# EAGLE design PMXAS5600N12_V1.0 (EAGLE 9.2.2)
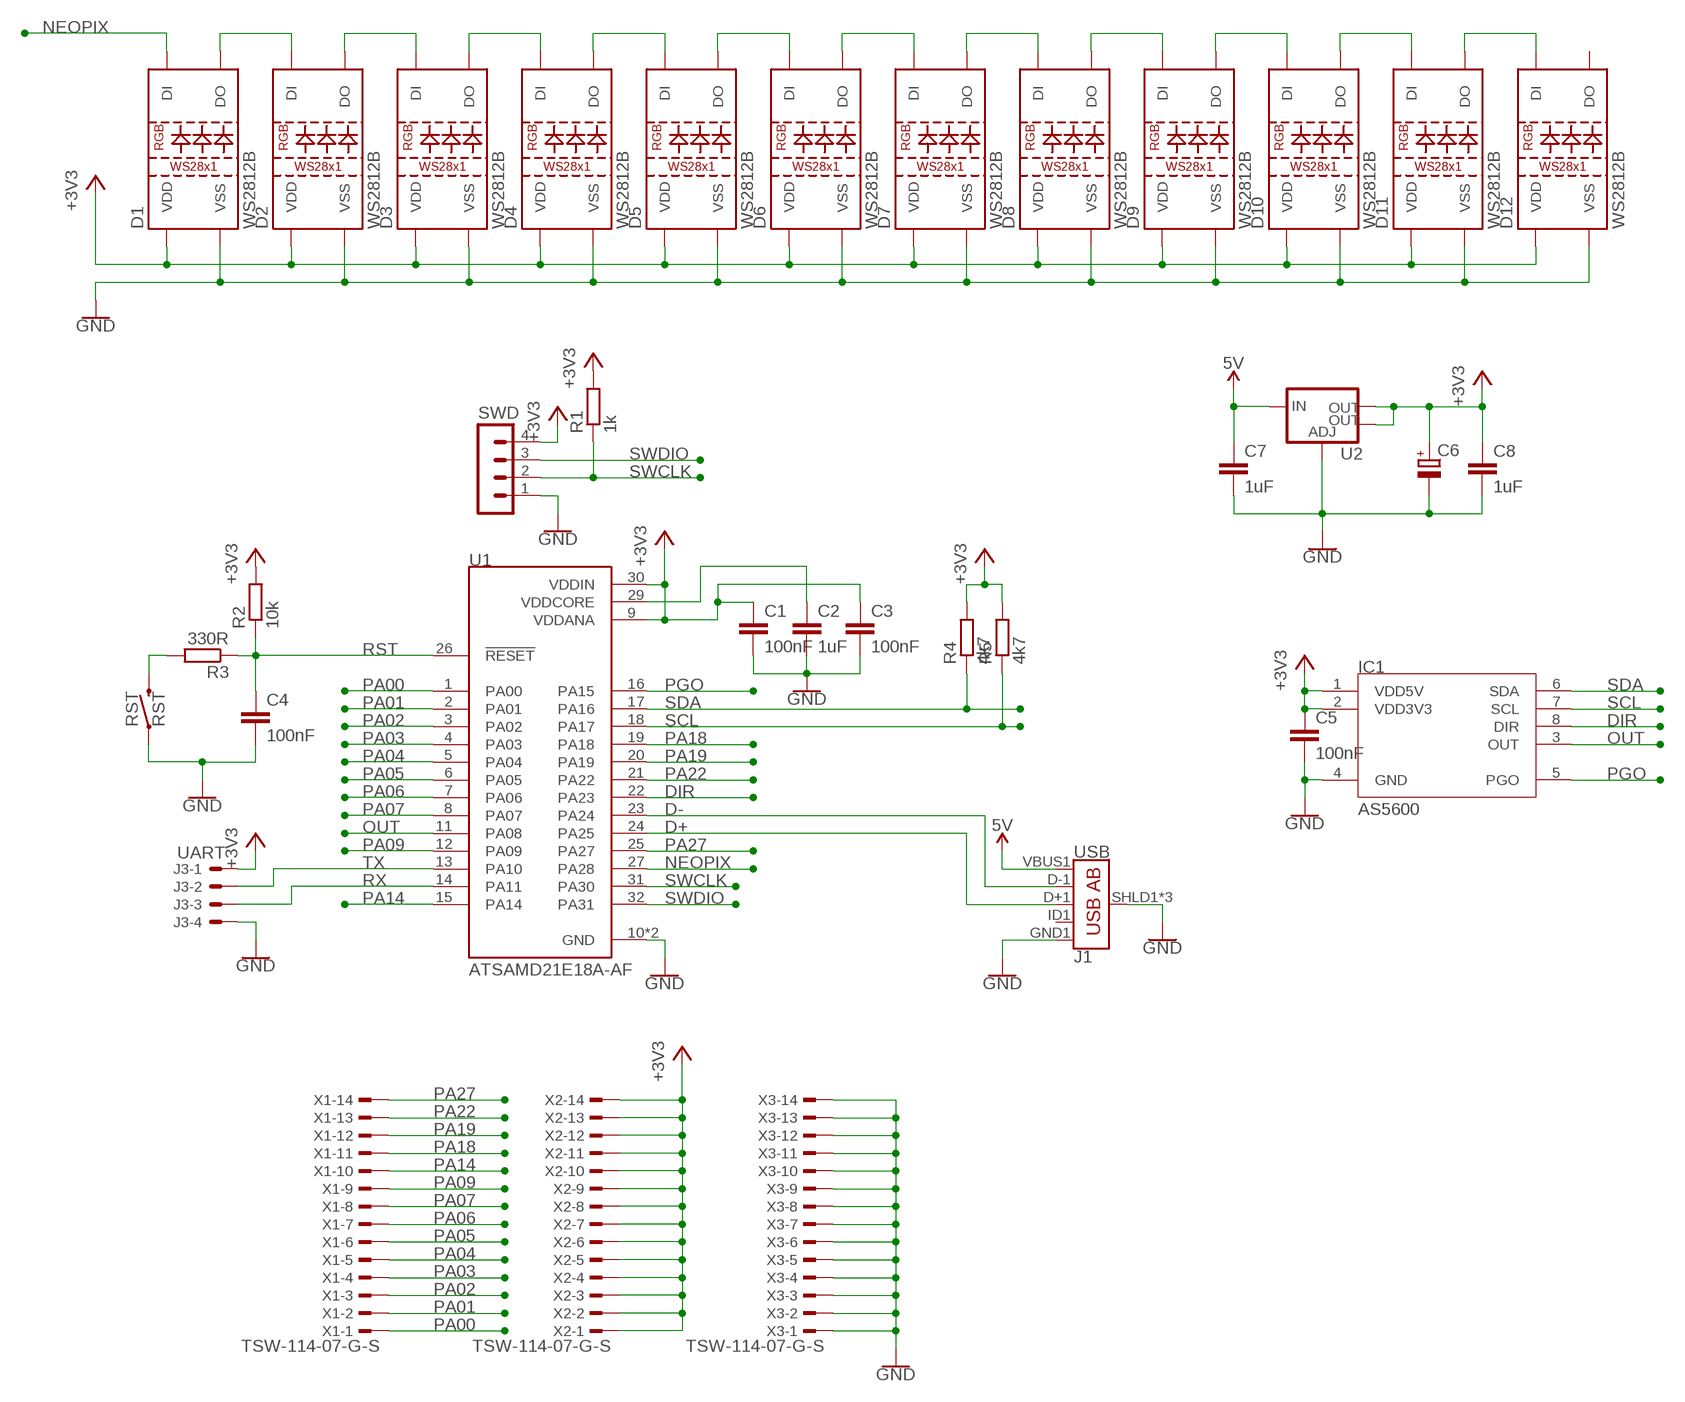
[diagram p0: schematic, sheet 1]

## Parts
C1  100nF  C-EUC0603  [C0603]
C2  1uF  C-EUC0603  [C0603]
C3  100nF  C-EUC0603  [C0603]
C4  100nF  C-EUC0603  [C0603]
C5  100nF  C-EUC0603  [C0603]
C6  CPOL-EU153CLV-0605  [153CLV-0605]
C7  1uF  C-EUC0603  [C0603]
C8  1uF  C-EUC0603  [C0603]
D1  WS2812B  [WS2812B]
D2  WS2812B  [WS2812B]
D3  WS2812B  [WS2812B]
D4  WS2812B  [WS2812B]
D5  WS2812B  [WS2812B]
D6  WS2812B  [WS2812B]
D7  WS2812B  [WS2812B]
D8  WS2812B  [WS2812B]
D9  WS2812B  [WS2812B]
D10  WS2812B  [WS2812B]
D11  WS2812B  [WS2812B]
D12  WS2812B  [WS2812B]
IC1  AS5600  [SOIC8]
J1  USB  USB_AB_SMT  [USB-AB-MICRO-SMD]
J3  UART  22-05-7048-04  [7395-04]
R1  1k  R-EU_R0603  [R0603]
R2  10k  R-EU_R0603  [R0603]
R3  330R  R-EU_R0603  [R0603]
R4  4k7  R-EU_R0603  [R0603]
R5  4k7  R-EU_R0603  [R0603]
RST  RST  MOMENTARY-SWITCH-SPST-SMD-5.2MM  [TACTILE_SWITCH_SMD_5.2MM]
SWD  MA04-1  [MA04-1]
U1  ATSAMD21E18A-AF  [QFP80P900X900X120-32N]
U2  V_REG_LM1117SOT223  [SOT223]
X1  TSW-114-07-G-S  [TSW-114-XX-G-S]
X2  TSW-114-07-G-S  [TSW-114-XX-G-S]
X3  TSW-114-07-G-S  [TSW-114-XX-G-S]

## Nets
5V: C7.1 J1.VBUS1(VBUS) U2.3(IN)
+3V3: C1.1 C3.1 C5.1 C6.+ C8.1 D1.1(VDD) D2.1(VDD) D3.1(VDD) D4.1(VDD) D5.1(VDD) D6.1(VDD) D7.1(VDD) D8.1(VDD) D9.1(VDD) D10.1(VDD) D11.1(VDD) D12.1(VDD) IC1.1(VDD5V) IC1.2(VDD3V3) J3.1 R1.2 R2.2 R4.2 R5.2 SWD.4 U1.9(VDDANA) U1.30(VDDIN) U2.2(OUT) U2.4(OUT) X2.1 X2.2 X2.3 X2.4 X2.5 X2.6 X2.7 X2.8 X2.9 X2.10 X2.11 X2.12 X2.13 X2.14
D+: J1.D+1(D+) U1.24(PA25)
D-: J1.D-1(D-) U1.23(PA24)
DIR: IC1.8(DIR) U1.22(PA23)
GND: C1.2 C2.2 C3.2 C4.2 C5.2 C6.- C7.2 C8.2 D1.3(VSS) D2.3(VSS) D3.3(VSS) D4.3(VSS) D5.3(VSS) D6.3(VSS) D7.3(VSS) D8.3(VSS) D9.3(VSS) D10.3(VSS) D11.3(VSS) D12.3(VSS) IC1.4(GND) J1.GND1(GND) J1.SHLD1(SHIELD) J1.SHLD2(SHIELD) J1.SHLD3(SHIELD) J3.4 RST.1 SWD.1 U1.10(GND) U1.28(GND) U2.1(ADJ) X3.1 X3.2 X3.3 X3.4 X3.5 X3.6 X3.7 X3.8 X3.9 X3.10 X3.11 X3.12 X3.13 X3.14
N$1: D1.2(DO) D2.4(DI)
N$3: D2.2(DO) D3.4(DI)
N$4: D3.2(DO) D4.4(DI)
N$6: D4.2(DO) D5.4(DI)
N$7: D5.2(DO) D6.4(DI)
N$8: D6.2(DO) D7.4(DI)
N$9: D7.2(DO) D8.4(DI)
N$10: D8.2(DO) D9.4(DI)
N$11: D9.2(DO) D10.4(DI)
N$12: D10.2(DO) D11.4(DI)
N$13: D11.2(DO) D12.4(DI)
N$14: R3.2 RST.3
NEOPIX: D1.4(DI) U1.27(PA28)
OUT: IC1.3(OUT) U1.11(PA08)
PA00: U1.1(PA00) X1.1
PA01: U1.2(PA01) X1.2
PA02: U1.3(PA02) X1.3
PA03: U1.4(PA03) X1.4
PA04: U1.5(PA04) X1.5
PA05: U1.6(PA05) X1.6
PA06: U1.7(PA06) X1.7
PA07: U1.8(PA07) X1.8
PA09: U1.12(PA09) X1.9
PA14: U1.15(PA14) X1.10
PA18: U1.19(PA18) X1.11
PA19: U1.20(PA19) X1.12
PA22: U1.21(PA22) X1.13
PA27: U1.25(PA27) X1.14
PGO: IC1.5(PGO) U1.16(PA15)
RST: C4.1 R2.1 R3.1 U1.26(!RESET)
RX: J3.3 U1.14(PA11)
SCL: IC1.7(SCL) R5.1 U1.18(PA17)
SDA: IC1.6(SDA) R4.1 U1.17(PA16)
SWCLK: R1.1 SWD.2 U1.31(PA30)
SWDIO: SWD.3 U1.32(PA31)
TX: J3.2 U1.13(PA10)
VDDCORE: C2.1 U1.29(VDDCORE)
Unconnected: D12.2(DO) J1.ID1(USBID)

## Library data of the parts
C1-C5 C7 C8 = rcl:C-EU: CAPACITOR, European symbol; SPICEPREFIX: C
C6 = rcl:CPOL-EU: POLARIZED CAPACITOR, European symbol; SPICEPREFIX: C
D1-D12 = SparkFun-LED:WS2812B: WS2812B SMD addressable RGB LED 5x5mm SMD LED with built-in controller IC. Color: Red/Green/Blue mC Rating: RGB: 390, 660, 180 mcd Forward Voltage: RGB: 2.0, 3.0, 3.0 V Packages:WS2812B SparkFun Products: Blynk Board - ESP8266 <https://www.sparkfun.com/products/13794>; PROD_ID: DIO-12503
IC1 = MagneticEncodersIC:AS5600
J1 = SparkFun-Connectors:USB_AB: USB Type AB Micro Connector OTG-compatible. 5 pins, 3 shield pins SparkFun Products: IOIO-OTG <https://www.sparkfun.com/products/13613> SparkFun SAMD21 Mini Breakout <https://www.sparkfun.com/products/13664>; PROD_ID: CONN-11794
J3 = con-molex:22-?-04: CONNECTOR wire to board 2.54 mm (.1 inch) pitch header; MF: MOLEX; OC_FARNELL: unknown; OC_NEWARK: unknown
R1-R5 = rcl:R-EU_: RESISTOR, European symbol; SPICEPREFIX: R
RST = SparkFun-Switches:MOMENTARY-SWITCH-SPST: Momentary Switch (Pushbutton) - SPST Normally-open (NO) SPST momentary switches (buttons, pushbuttons). Variants PTH-12MM - 12mm square, through-hole Momentary Pushbutton Switch - 12mm Square <https://www.sparkfun.com/products/9190> (COM-09190) PTH-6.0MM, PTH-6.0MM-KIT - 6.0mm square, through-hole Mini Pushbutton Switch <https://www.sparkfun.com/products/97> (COM-00097) KIT package intended for soldering kit's - only one side of pads' copper is exposed. PTH-RIGHT-ANGLE-KIT - Right-angle, through-hole Right Angle Tactile Button <https://www.sparkfun.com/products/10791> - Used on SparkFun BigTime Watch Kit <https://www.sparkfun.com/products/11734> SMD-12MM - 12mm square, surface-mount Tactile Button - SMD (12mm) <https://www.sparkfun.com/products/12993> (COM-12993) Used on SparkFun PicoBoard <https://www.sparkfun.com/products/11888> SMD-4.5MM - 4.5mm Square Trackball Switch Used on SparkFun Blackberry Trackballer Breakout <https://www.sparkfun.com/products/13169> SMD-4.6MMX2.8MM - 4.60mm x 2.80mm, surface mount Used on SparkFun SAMD21 Mini Breakout <https://www.sparkfun.com/products/13664> SMD-5.2MM, SMD-5.2-REDUNDANT - 5.2mm square, surface-mount Mini Pushbutton Switch - SMD <https://www.sparkfun.com/products/8720> (COM-08720) Used on Arduino Pro Mini <https://www.sparkfun.com/products/11114> REDUNDANT package connects both switch circuits together SMD-6.0X3.5MM - 6.0 x 3.5mm, surface mount Momentary Reset Switch SMD <https://www.sparkfun.com/products/8229> (COM-08229) SMD-6.2MM-TALL - 6.2mm square, surface mount Tactile Button - SMD (6mm) <https://www.sparkfun.com/products/12992> Used on SparkFun Digital Sandbox <https://www.sparkfun.com/products/12651> SMD-RIGHT-ANGLE - Right-angle, surface mount Used on SparkFun Block for Intel� Edison - Arduino <https://www.sparkfun.com/products/13036>; PROD_ID: SWCH-08247; SF_SKU: COM-08720
SWD = con-lstb:MA04-1: PIN HEADER; OC_FARNELL: unknown; OC_NEWARK: unknown
U1 = ATSAMD21E18A-AF:ATSAMD21E18A-AF: The SAM D21 is a series of low-power microcontrollers using the 32-bit ARM® Cortex® -M0+ processor, and ranging from 32- to 64-pins with up to 256KB Flash and 32KB of SRAM. The SAM D21 operate at a maximum frequency of 48MHz and reach 2.46 CoreMark® /MHz.; AVAILABILITY: Unavailable; DESCRIPTION: MCU 32-Bit SAM D21E ARM Cortex M0+ RISC 256KB Flash 3.3V 32-Pin TQFP Tray; MF: Microchip; MP: ATSAMD21E18A-AF; PACKAGE: TQFP-32 Microchip; PRICE: None
U2 = SparkFun-IC-Power:V_REG_LM1117: Voltage Regulator LM1117 Standard adjustable voltage regulator but in SMD form. Spark Fun Electronics SKU : COM-00595; PROD_ID: VREG-08170
X1-X3 = con-samtec:TSW-114-*-G-S: THROUGH-HOLE .025" SQ POST HEADER Source: Samtec TSW.pdf; MF: Samtec Inc.; MPN: TSW-114-07-G-S

## Net classes
0 default: width 0.254 mm

## Board
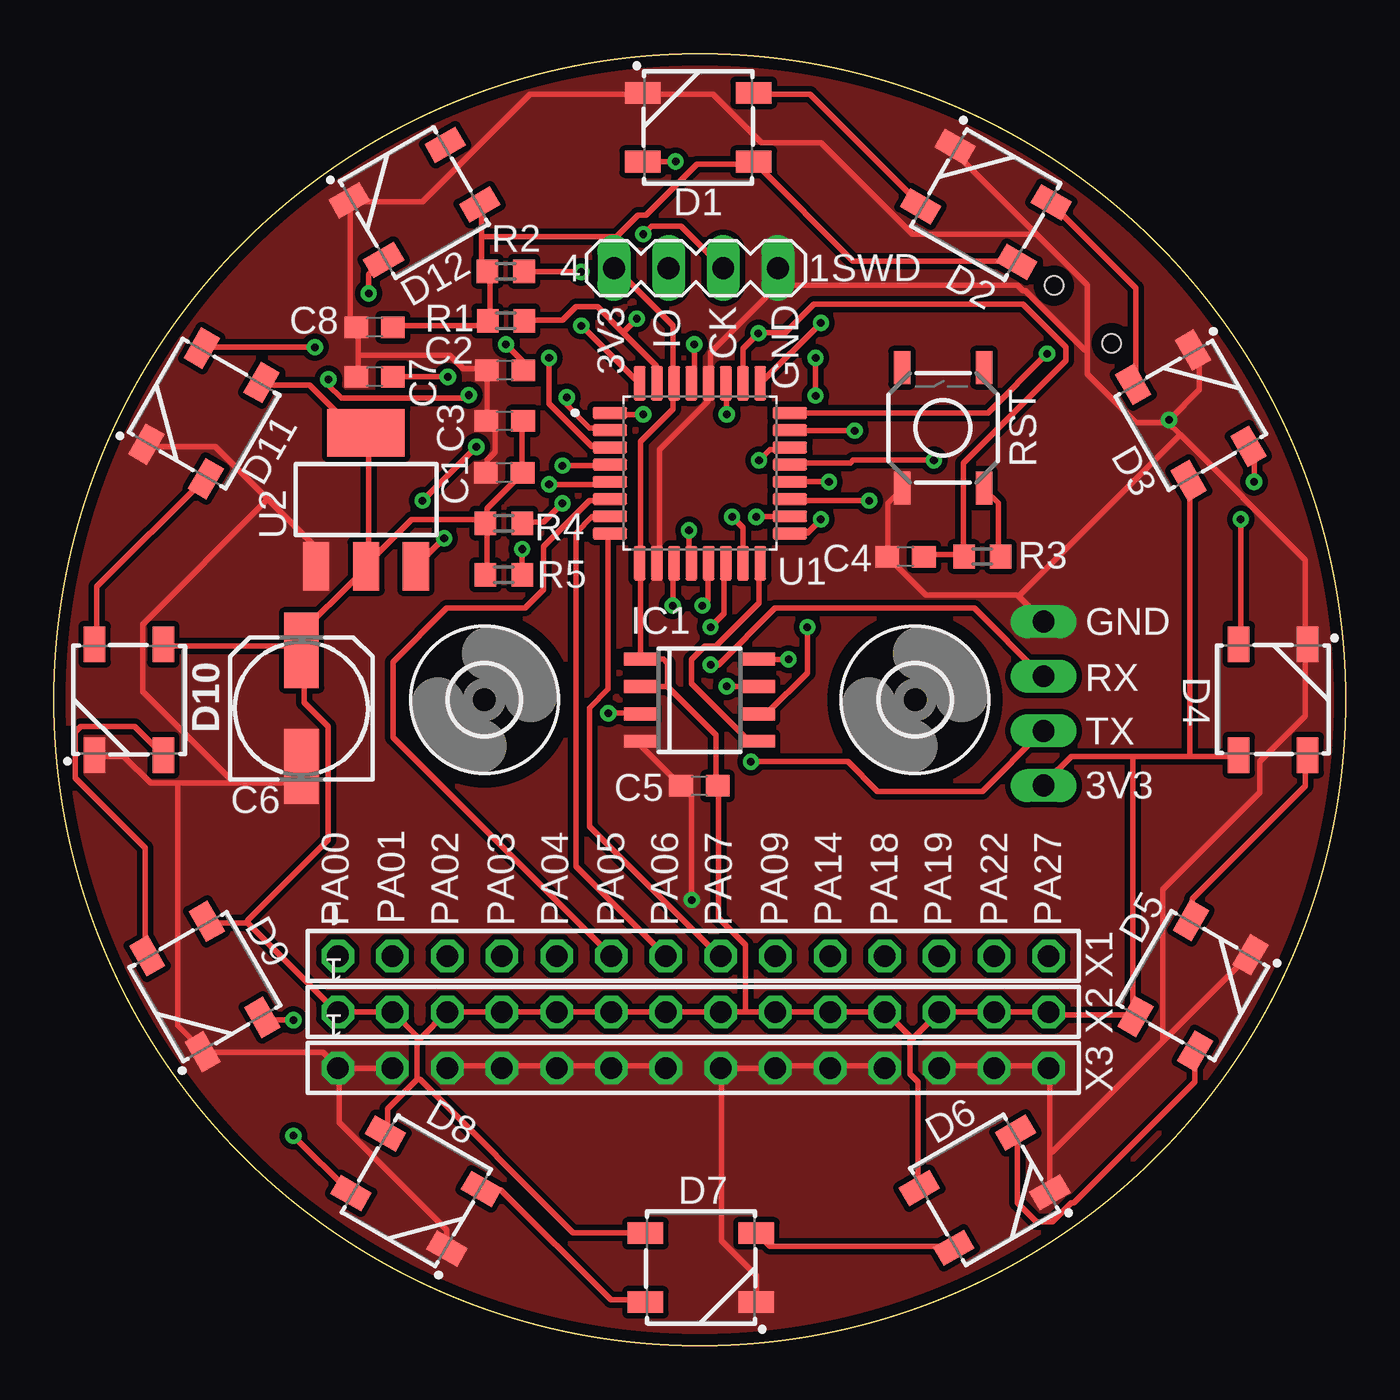
[diagram p1: board, top side]
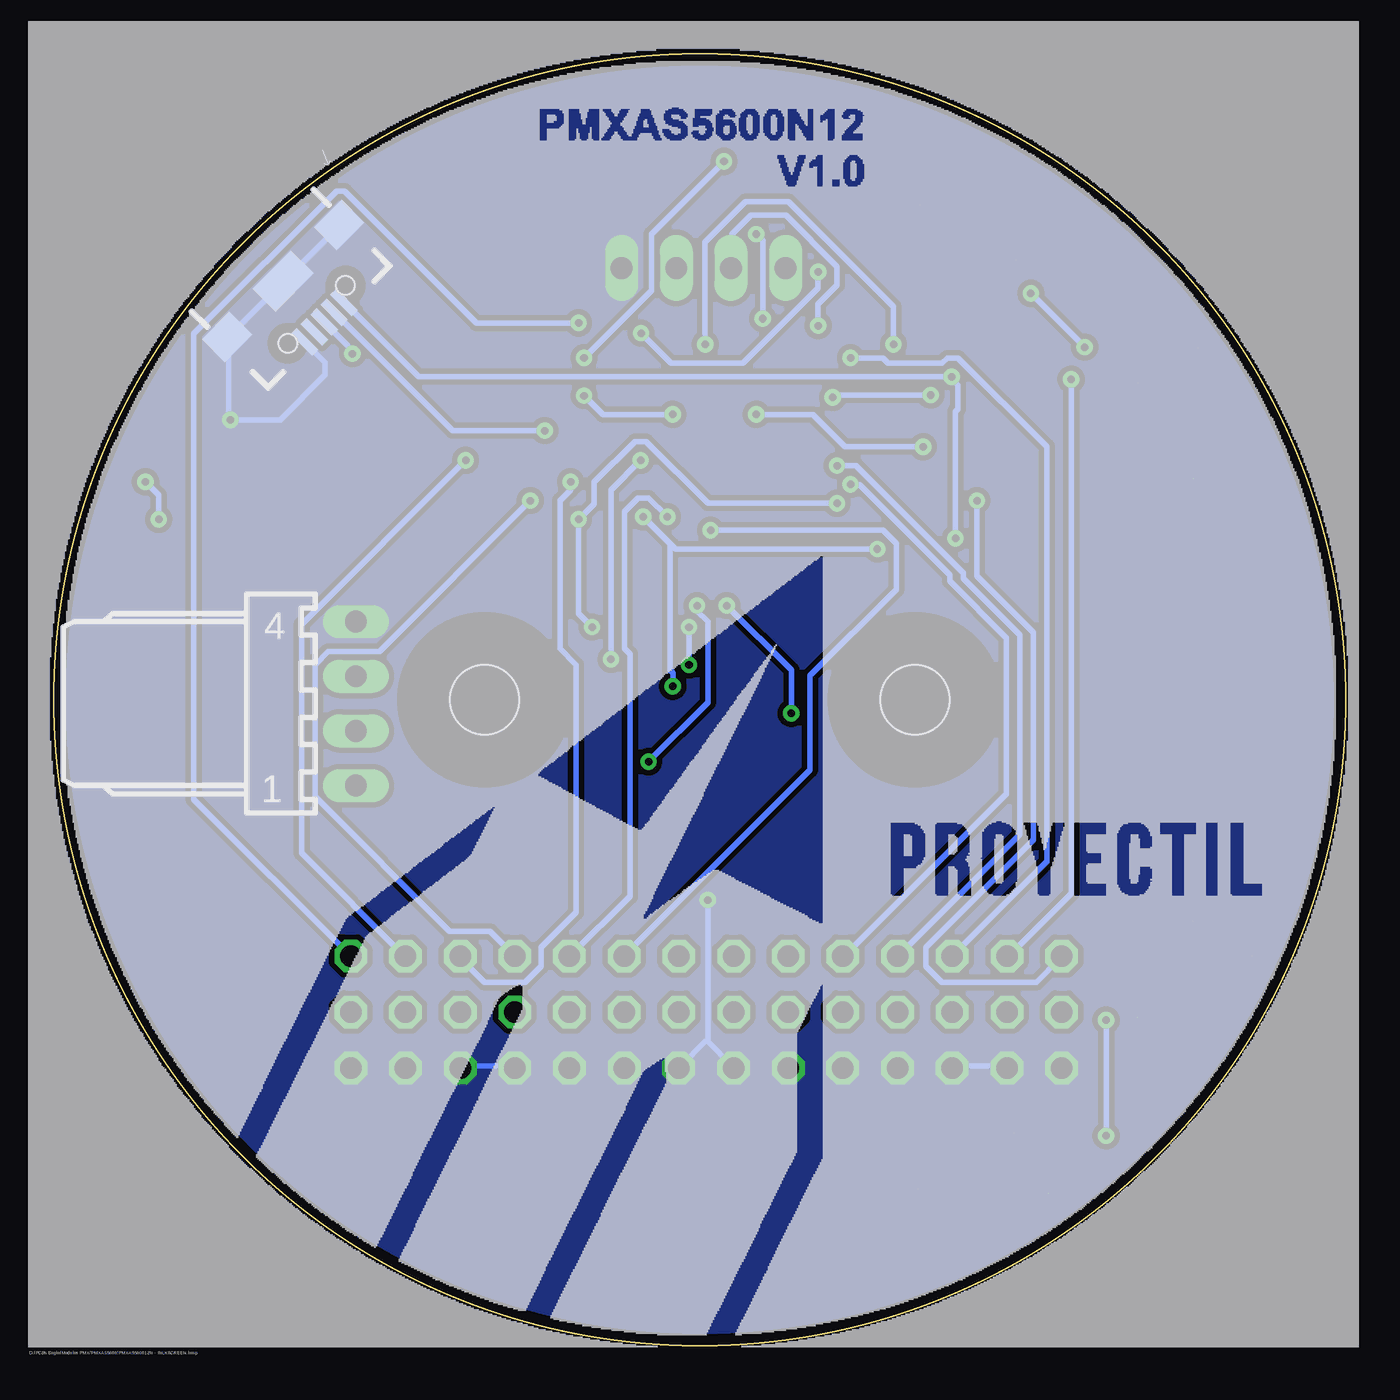
[diagram p2: board, bottom side, seen from below]

Size 60 x 60 mm. Coordinates in mm from the lower left corner, seen from the top.
Outline: circle at 30,30 radius 30
Copper layers (1*16): Top 0.035mm / dielectric 1.5mm / Bottom 0.035mm
Design rules "default *": minimum track width 10mil, minimum drill 0.35mm, track to track 10mil, track to pad 10mil, pad to pad 10mil, via to via 10mil, smd to smd 10mil, copper to edge 20mil, drill to drill 6mil, minimum pad ring 10mil, minimum via ring 8mil, stop-mask expansion 4mil, vias tented up to drill 0mil, thermal gap 10mil

### Footprints (pad centres in the part's own frame; a part is rotated, then mirrored left to right if it is on the bottom)
C0603 = smd 1.1 x 1: 1 -0.85,0; 2 0.85,0
153CLV-0605 = smd 3.5 x 1.6: + 2.7,0; - -2.7,0
WS2812B = smd 1.651 x 1: 1 2.577,-1.6; 2 2.577,1.6; 3 -2.577,1.6; 4 -2.577,-1.6
SOIC8 = smd 0.6 x 1.5: 1 -1.905,-2.75; 2 -0.635,-2.75; 3 0.635,-2.75; 4 1.905,-2.75; 5 1.905,2.75; 6 0.635,2.75; 7 -0.635,2.75; 8 -1.905,2.75
USB-AB-MICRO-SMD = smd 1.4 x 0.4: D+1 2.7,0; D-1 2.7,0.65; GND1 2.7,-1.3; ID1 2.7,-0.65; VBUS1 2.7,1.3 | smd 1.5 x 1.8: SHLD1 0,-3.68; SHLD2 0,3.68 | smd 1.5 x 2.5: SHLD3 0,0 | hole 0.85: 2.2,1.9; 2.2,-1.9
7395-04 = drill 1.016 long: 1 3.81,0; 2 1.27,0; 3 -1.27,0; 4 -3.81,0
R0603 = smd 1 x 1.1: 1 -0.85,0; 2 0.85,0
TACTILE_SWITCH_SMD_5.2MM = smd 1.524 x 0.762: 1 -2.794,1.905; 2 2.794,1.905; 3 -2.794,-1.905; 4 2.794,-1.905
MA04-1 = drill 1.016 long: 1 -3.81,0; 2 -1.27,0; 3 1.27,0; 4 3.81,0
QFP80P900X900X120-32N = smd 1.6 x 0.55: 1 -4.18,2.8; 2 -4.18,2; 3 -4.18,1.2; 4 -4.18,0.4; 5 -4.18,-0.4; 6 -4.18,-1.2; 7 -4.18,-2; 8 -4.18,-2.8; 17 4.18,-2.8; 18 4.18,-2; 19 4.18,-1.2; 20 4.18,-0.4; 21 4.18,0.4; 22 4.18,1.2; 23 4.18,2; 24 4.18,2.8 | smd 0.55 x 1.6: 9 -2.8,-4.18; 10 -2,-4.18; 11 -1.2,-4.18; 12 -0.4,-4.18; 13 0.4,-4.18; 14 1.2,-4.18; 15 2,-4.18; 16 2.8,-4.18; 25 2.8,4.18; 26 2,4.18; 27 1.2,4.18; 28 0.4,4.18; 29 -0.4,4.18; 30 -1.2,4.18; 31 -2,4.18; 32 -2.8,4.18
SOT223 = smd 1.219 x 2.235: 1 -2.311,-3.099; 2 0,-3.099; 3 2.311,-3.099 | smd 3.6 x 2.2: 4 0,3.099
3,2 = hole 3.2: 0,0
TSW-114-XX-G-S = drill 1 pad 1.5 octagon: 1 16.51,0; 2 13.97,0; 3 11.43,0; 4 8.89,0; 5 6.35,0; 6 3.81,0; 7 1.27,0; 8 -1.27,0; 9 -3.81,0; 10 -6.35,0; 11 -8.89,0; 12 -11.43,0; 13 -13.97,0; 14 -16.51,0

### Placement (x,y rotation side)
C1  20.92,40.55 180 top
C2  20.96,45.3 180 top
C3  20.94,42.95 180 top
C4  39.56,36.65 180 top
C5  29.98,26 180 top
C6  11.5,29.6 90 top
C7  14.9,45 180 top
C8  14.9,47.3 180 top
D1  29.93,56.59 0 top
D2  43.29,53.01 330 top
D3  52.81,43.21 300 top
D4  56.63,30.01 270 top
D5  52.91,16.72 240 top
D6  43.23,7.22 210 top
D7  30.05,3.62 180 top
D8  16.83,7.18 150 top
D9  7.01,16.68 120 top
D10  3.49,30 90 top
D11  6.97,43.3 60 top
D12  16.75,53.1 30 top
IC1  29.99,29.98 270 top
J1  49.35,49.45 315 bottom
J3  45.97,29.82 270 bottom
R1  21,47.6 180 top
R2  20.99,49.9 180 top
R3  43.12,36.65 0 top
R4  20.9,38.2 180 top
R5  20.9,35.8 180 top
RST  41.3,42.63 90 top
SWD  29.82,50.05 180 top
U1  30.01,40.52 0 top
U2  14.5,39.3 0 top
U$1  [3,2]  20,30 0 top
U$2  [3,2]  40,30 0 top
X1  29.7,18.1 180 top
X2  29.7,15.5 180 top
X3  29.7,12.9 180 top

### Tracks (layer width: path | path; a pad name or v marks a point on that pad's centre or on a via)
5V  (via drill 0.35)
  Top 0.254: v18.3,45 C7.1 | v18.12,37.5 16.88,36.25 U2.3
  Bottom 0.254: J1.VBUS1 43.06,45 v18.3,45 18.25,44.88 18,44.62 18,43.5 18.12,43.38 v18.12,37.5
+3V3  (4 unrouted)
  Top 0.254: D11.1 9.75,44.62 11.88,44.62 14,42.5 14.5,42.5 U2.4 14.62,42.38 14.62,36.5 U2.2 | R5.2 20.12,35.88 20.12,38.12 R4.2 | C3.1 21.75,42.88 21.75,40.62 C1.1 21.75,40.5 20.12,38.88 20.12,38.25 R4.2 | D10.1 5.12,32.5 11.38,32.5 11.5,32.38 C6.+ | U2.2 14.5,36.12 11,32.62 C6.+ | R4.2 20,38.38 16.62,38.38 14.5,36.25 U2.2 | 9,19.62 7.12,19.62 D9.1 | 9,19.62 13.12,15.5 X2.1 X2.2 15.75,15.5 16.88,14.38 16.88,14.25 | 16.88,12.38 15.5,11 15.5,9.88 D8.1 | 16.88,14.25 16.88,12.38 | D7.1 27.38,5.25 24.12,5.25 17,12.38 16.88,12.38 | 16.88,14.25 17,14.25 18.25,15.5 X2.3 X2.4 X2.5 X2.6 X2.7 X2.8 32.12,15.5 | C6.+ 11.62,32.25 11.62,29.88 12.75,28.75 12.75,23.5 9,19.75 9,19.62 | C8.1 15.75,47.38 20,47.38 20.12,47.5 R1.2 20.25,47.62 20.25,49.88 R2.2 20.12,50 19.88,50.25 19.88,51.5 | 19.88,51.5 19.88,53 D12.1 | SWD.4 26.12,50 28.75,47.38 28.75,44.75 U1.30 28.75,44.62 28.75,43.5 27.25,42 27.25,36.38 U1.9 27.25,36.25 27.25,32 IC1.1 28.31,31.89 28.51,31.69 28.51,30.62 | SWD.4 26.12,50.12 26.12,51.5 27.12,52.5 27.5,52.5 29.88,54.88 32.5,54.88 D1.1 32.62,54.88 37.12,50.38 44.62,50.38 D2.1 | 19.88,51.5 26,51.5 SWD.4 | 50.12,27.38 47.25,27.38 46,26.12 J3.1 | 50.12,27.38 52.75,27.38 | 52.75,27.38 55,27.38 D4.1 | 52.75,27.38 52.75,40.12 D3.1 | 39.75,14.25 39.75,14.38 38.62,15.5 X2.11 X2.10 X2.9 32.12,15.5 | 39.75,14.25 39.75,12.62 40.12,12.25 40.12,7.38 D6.1 | 39.75,14.25 39.88,14.25 X2.12 X2.13 X2.14 46.25,15.5 46.38,15.38 50.12,15.38 D5.1 50.12,15.5 50.12,27.38 | 32.12,15.5 32.12,18.62 30.88,19.88 30.88,25.88 C5.1 30.75,26 30.75,28.38 28.51,30.62 | IC1.2 28.51,30.62
D+  (via drill 0.35)
  Top 0.254: U1.24 43.37,43.32 v46.13,46.07
  Bottom 0.254: v46.13,46.07 46.23,46.17 46.23,46.33 J1.D+1
D-  (via drill 0.35)
  Top 0.254: v37.2,42.5 34.21,42.5 U1.23
  Bottom 0.254: J1.D-1 41.48,42.5 v37.2,42.5
DIR  (via drill 0.35)
  Top 0.254: v34.12,31.88 IC1.8 | v32.75,41.12 33.25,41.62 34.12,41.62 U1.22
  Bottom 0.254: v34.12,31.88 34.12,39.75 v32.75,41.12
GND  (via drill 0.35)
  Top 0.254: v51.8,43 53.2,44.4 53.2,45.95 D3.3 | C1.2 20.12,40.62 20.12,41.12 20.5,41.5 20.5,42.5 20.12,42.88 C3.2 20.12,43 20.12,45.25 C2.2 20,45.38 19,45.38 18.38,46 14.12,46 | 14.12,46 14.12,47.25 C8.2 14,47.38 13.75,47.62 13.75,53.12 D12.3 13.88,53.12 17.12,53.12 22.12,58.12 27.25,58.12 D1.3 27.38,58.12 30.62,58.12 32.88,55.88 35.62,55.88 39.88,51.62 45.5,51.62 45.56,51.69 | 14.12,46 14.12,45 C7.2 | U1.10 28.12,36.38 28.12,41.62 30.38,43.88 30.38,44.62 U1.28 30.5,44.75 30.5,46.12 33.62,49.25 33.62,50 SWD.1 33.75,49.25 44.75,49.25 45,49 45.12,49 47.88,46.25 48,46.25 | RST.1 39.38,39.75 38.75,39.12 38.75,36.75 C4.2 38.75,36.62 40.5,34.88 44.75,34.88 | 44.75,34.88 45.88,33.75 J3.4 | 52.31,42.31 51.75,42.88 v51.8,43 | 52.31,42.31 58.12,36.5 58.12,32.62 D4.3 58.12,32.5 58.12,29.25 56,27.12 56,25.7 51.5,21.2 51.5,14.25 51.56,14.19 | 45.56,51.69 48,49.25 48,46.25 | 45.56,51.69 41.88,55.38 41.88,55.62 D2.3 | 48,46.25 48,45.12 50.25,42.88 51.62,42.88 v51.8,43 | 52.31,42.31 44.88,34.88 44.75,34.88 | 9.94,39.31 12.12,37.12 12.12,36.25 U2.1 | 9.94,39.31 7.5,41.75 4.38,41.75 D11.3 | 8.25,26.12 10.75,26.12 11.5,26.88 C6.- | 8.25,26.12 5.75,26.12 | 5.75,26.12 4.5,26.12 3.25,27.38 2,27.38 D10.3 | D8.3 18.25,4.62 18.25,5.38 13.25,10.38 13.25,12.88 X3.1 | X3.1 13.12,13 12.5,13.62 7,13.62 D9.3 6.88,13.75 5.75,14.88 5.75,26.12 | X3.2 15.62,12.88 13.38,12.88 X3.1 | 9.94,39.31 4.12,33.5 4.12,30.38 8.25,26.25 8.25,26.12 | X3.12 41.25,13 43.62,13 X3.13 43.75,13 46.12,13 X3.14 46.25,12.88 46.25,9 | 46.25,9 D6.3 | 51.56,14.19 46.38,9 46.25,9 | 51.56,14.19 55.5,18.12 D5.3 | X3.11 38.5,13 36.12,13 X3.10 36,13 33.62,13 X3.9 33.5,12.88 31.12,12.88 X3.8 31,12.88 31,4.88 32.62,3.25 32.62,2.12 D7.3
  Top 0.254: X3.3 18.38,13 20.75,13 X3.4 20.88,13 23.25,13 X3.5 23.38,13 25.88,13 X3.6 26,13 28.38,13 X3.7 | IC1.4 27.12,28 C5.2 29.62,25.51 v29.62,20.7
  Bottom 0.254: J1.GND1 47.4,45.66 47.4,45.1 49.5,43 v51.8,43 51.88,43 51.88,46.75 J1.SHLD1 51.88,46.88 49.38,49.38 J1.SHLD3 49.25,49.5 46.75,52 J1.SHLD2 | 29.62,14.12 v29.62,20.7 | 29.62,14.12 28.5,13 X3.7 | X3.8 30.88,13 29.75,14.12 29.62,14.12 | X3.12 41.12,13 38.62,13 X3.11 | X3.2 15.75,13 18.25,13 X3.3
  pour Top (no thermals): 30,0 29.9,0 arc-90 -0.1,30 arc-90 29.9,60 30,60 arc-90 60,30 arc-90
  pour Bottom (no thermals): 30,0 29.9,0 arc-90 -0.1,30 arc-90 29.9,60 30,60 arc-90 60,30 arc-90
N$1
  Top 0.254: D1.2 32.62,58.12 35.12,58.12 40.25,53 D2.4
N$3
  Top 0.254: D3.4 50.25,44.75 50.25,49.12 46.38,53 D2.2
N$4  (via drill 0.35)
  Top 0.254: v55.12,38.38 55.12,32.62 D4.4 | v55.75,40.12 55.75,41.5 55.5,41.75 D3.2
  Bottom 0.254: v55.12,38.38 55.12,39.5 v55.75,40.12
N$6
  Top 0.254: D5.4 52.88,19.88 52.88,20.75 58.12,26 58.12,27.38 D4.2
N$7
  Top 0.254: D6.4 44.75,9.88 44.75,6.62 45.62,5.75 46.38,5.75 47.25,6.62 47.38,6.62 53,12.25 53,13.62 D5.2
N$8
  Top 0.254: D6.2 41.75,4.62 33.25,4.62 32.75,5.12 D7.4
N$9  (1 unrouted)
  Top 0.254: D8.4 19.88,7.25 20.75,7.25 25.88,2.12 27.38,2.12 D7.2
N$10  (via drill 0.35)  (2 unrouted)
  Top 0.254: v11.12,15.12 9.75,15.12 D9.4 | v11.12,9.75 13.75,7.12 D8.2
  Bottom 0.254: v11.12,9.75 v11.12,15.12
N$11  (1 unrouted)
  Top 0.254: D9.2 4.25,18.12 4.25,23.12 1,26.38 1,28.5 1.25,28.75 3.75,28.75 5,27.5 D10.4
N$12  (1 unrouted)
  Top 0.254: D10.2 2,32.62 2,35.25 7,40.25 D11.4
N$13  (via drill 0.35)  (2 unrouted)
  Top 0.254: v12.12,46.38 6.88,46.38 D11.2 | v14.62,48.88 14.62,49.75 15.25,50.38 D12.4
  Bottom 0.254: v14.62,48.88 v12.12,46.38
N$14
  Top 0.254: R3.2 43.88,36.75 43.88,39.12 43.25,39.75 RST.3
NEOPIX  (via drill 0.35)
  Top 0.254: v31.25,43.25 31.25,44.62 U1.27 | v35.38,45.88 v35.38,44.12 | v28.88,55 27.38,55 D1.4
  Bottom 0.254: v31.25,43.25 34.5,43.25 v35.38,44.12 | v35.38,45.88 32.25,49 32.25,51.62 v28.88,55
OUT  (via drill 0.35)
  Top 0.254: v25.75,29.38 27.12,29.38 IC1.3 | v28.75,34.38 28.75,36.25 U1.11
  Bottom 0.254: v28.75,34.38 25.75,31.38 v25.75,29.38
PA00  (via drill 0.35)
  Top 0.254: v27.38,43.25 25.88,43.25 U1.1 | v17.12,39.25 v19.62,41.75
  Bottom 0.254: v27.38,43.25 24.75,43.25 23.25,41.75 v19.62,41.75 | v17.12,39.25 17.12,35.75 14.5,33.12 14.5,23.5 19.5,18.5 19.5,17.62 18.75,16.88 14.38,16.88 13.25,18 X1.1
PA01  (via drill 0.35)
  Top 0.254: v23.83,44.05 23.83,43.67 24.88,42.62 25.75,42.62 U1.2 | v19.27,44.15 19.12,44 13.38,44 12.75,44.62 v12.75,44.88
  Bottom 0.254: v23.83,44.05 23.72,44.15 v19.27,44.15 | v12.75,44.88 12.75,21 15.62,18.12 X1.2
PA02  (via drill 0.35)
  Top 0.254: v23,45.88 23,43.75 25,41.75 25.75,41.75 U1.3
  Bottom 0.254: v23,45.88 21.5,45.88 21.25,45.62 18.75,45.62 18.5,45.88 18,45.88 13.88,41.75 13.88,22.5 18.25,18.12 X1.3
PA03  (via drill 0.35)
  Top 0.254: v23.62,40.88 25.75,40.88 U1.4
  Bottom 0.254: v23.62,40.88 22.75,40.88 17.75,35.88 17.75,35.62 15.12,33 15.12,23.75 20.75,18.12 X1.4
PA04  (via drill 0.35)
  Top 0.254: v23,40 25.75,40 U1.5
  Bottom 0.254: X1.5 23.25,18.12 15.75,25.62 15.75,32.88 18.39,35.51 18.39,35.79 22.59,40 v23,40
PA05
  Top 0.254: U1.6 25.75,39.25 24.88,39.25 22.75,37.12 22.75,35.12 21.88,34.25 18.25,34.25 15.75,31.75 15.75,28.25 25.88,18.12 X1.6
PA06
  Top 0.254: U1.7 25.75,38.5 25,38.5 24.25,37.75 24.25,22.25 28.38,18.12 X1.7
PA07
  Top 0.254: U1.8 25.75,37.62 25.75,30.5 24.88,29.62 24.88,24.12 30.88,18.12 X1.8
PA09  (via drill 0.35)
  Top 0.254: v29.5,37.88 29.5,36.38 U1.12
  Bottom 0.254: v29.5,37.88 21.5,37.88 20.88,37.25 20.88,35.12 24.88,31.12 24.88,26.75 33.5,18.12 X1.9
PA14  (via drill 0.35)
  Top 0.254: v31.5,38.5 32,38 32,36.38 U1.15
  Bottom 0.254: v31.5,38.5 32.38,39.38 32.88,39.38 33.5,38.75 33.5,32.38 33.25,32.12 33.25,20.88 36,18.12 X1.10
PA18  (via drill 0.35)
  Top 0.254: v37.88,39.25 34.25,39.25 U1.19
  Bottom 0.254: v37.88,39.25 44.88,32.25 47.25,32.25 47.88,31.62 47.88,25.5 41.62,19.25 39.75,19.25 38.62,18.12 X1.11
PA19  (via drill 0.35)
  Top 0.254: v36,40.12 34.25,40.12 U1.20
  Bottom 0.254: v36,40.12 36,39.75 36.5,39.25 36.5,32.38 35.75,31.62 35.75,20.12 37.38,18.5 37.38,17.62 38.12,16.88 40,16.88 41.12,18 X1.12
PA22  (via drill 0.35)
  Top 0.254: v40.88,41.12 37.12,41.12 37,41 34.25,41 U1.21
  Bottom 0.254: v40.88,41.12 48.5,33.5 48.5,22.88 43.75,18.12 X1.13
PA27  (via drill 0.35)
  Top 0.254: v35.62,47.5 32.88,44.75 U1.25
  Bottom 0.254: v35.62,47.5 40.38,47.5 46.5,53.62 46.88,53.62 53.5,47 53.5,25.38 46.25,18.12 X1.14
PGO
  Top 0.254: IC1.5 32.62,28.12 32.25,28.12 29.62,30.75 29.62,31.88 30.25,32.5 30.75,32.5 32.75,34.5 32.75,36.25 U1.16
RST  (via drill 0.35)
  Top 0.254: C4.1 40.5,36.75 42.25,36.75 R3.1 42.25,36.88 42.25,41 47,45.75 47,46.38 45,48.38 35.3,48.38 33.97,47.05 32.75,47.05 v32.72,47.03 32,46.3 32,44.75 U1.26 | v24.5,49.88 21.88,49.88 R2.1
  Bottom 0.254: v24.5,49.88 24.5,49.12 28,45.62 31.33,45.62 v32.72,47.03
RX  (via drill 0.35)
  Top 0.254: v30.5,33.38 31.12,34 31.12,36.25 U1.14 | v30.5,31.62 30.88,31.62 33.5,34.25 42.75,34.25 45.88,31.12 J3.3
  Bottom 0.254: v30.5,31.62 v30.5,33.38
SCL  (via drill 0.35)
  Top 0.254: v21.75,37 R5.1 | v32.62,38.5 34.12,38.5 U1.18 | v31.25,30.62 32.62,30.62 IC1.7
  Bottom 0.254: v21.75,37 31.12,37 31.31,37.19 | v32.62,38.5 31.31,37.19 | v31.25,30.62 31.25,31.25 31.38,31.38 31.38,37.12 31.31,37.19
SDA  (via drill 0.35)
  Top 0.254: v23.62,39.12 22.75,38.25 21.75,38.25 R4.1 | v35.62,38.38 35,37.75 34.25,37.75 U1.17 | v35,33.38 35,31.25 33.12,29.38 32.75,29.38 IC1.6
  Bottom 0.254: v23.62,39.12 29.62,39.12 32.5,42 33,42 34.9,40.1 34.9,39.1 v35.62,38.38 35.62,34 v35,33.38
SWCLK  (via drill 0.35)
  Top 0.254: 26.44,47.06 28,45.5 28,44.75 U1.31 | 26.44,47.06 25.25,48.25 24.25,48.25 23.62,47.62 21.88,47.62 R1.1 | v27.38,51.62 27.75,52 29.12,52 31,50.12 SWD.2 | 26.44,47.06 v27.08,47.7
  Bottom 0.254: v27.38,51.62 27.08,51.33 v27.08,47.7
SWDIO  (via drill 0.35)
  Top 0.254: v24.5,47.38 27.12,44.75 U1.32
  Bottom 0.254: v24.5,47.38 24.5,48.38 23.62,49.25 23.62,50.12 26,52.5 27.62,52.5 28.5,51.62 28.5,50.12 SWD.3
TX  (via drill 0.35)
  Top 0.254: v30.12,34.38 30.38,34.62 30.38,36.25 U1.13 | v32.38,27.12 36.88,27.12 38.25,25.75 43.12,25.75 45.88,28.5 J3.2
  Bottom 0.254: v30.12,34.38 30.12,34.12 29.62,33.62 29.62,29.88 v32.38,27.12
VDDCORE  (via drill 0.35)
  Top 0.254: v21,46.5 21.75,45.75 21.75,45.38 C2.1 | v29.75,46.5 29.75,44.88 29.62,44.75 U1.29
  Bottom 0.254: v21,46.5 21,48.25 25.88,53.12 27.88,53.12 29.75,51.25 v29.75,46.5

### Text on the board
tNames: IO | 3V3 | CK | GND | GND | RX | TX | 3V3 | PA00 | PA01 | PA02 | PA03 | PA04 | PA05 | PA06 | PA07 | PA09 | PA14 | PA18 | PA19 | PA22 | PA27
bNames: D:/PCBs Eagle/Modulos PMX/PMXAS5600/PMXAS560012N - SILKSCREEN.bmp